# EAGLE board A3660 (EAGLE 8.2.2), part 1 of 3
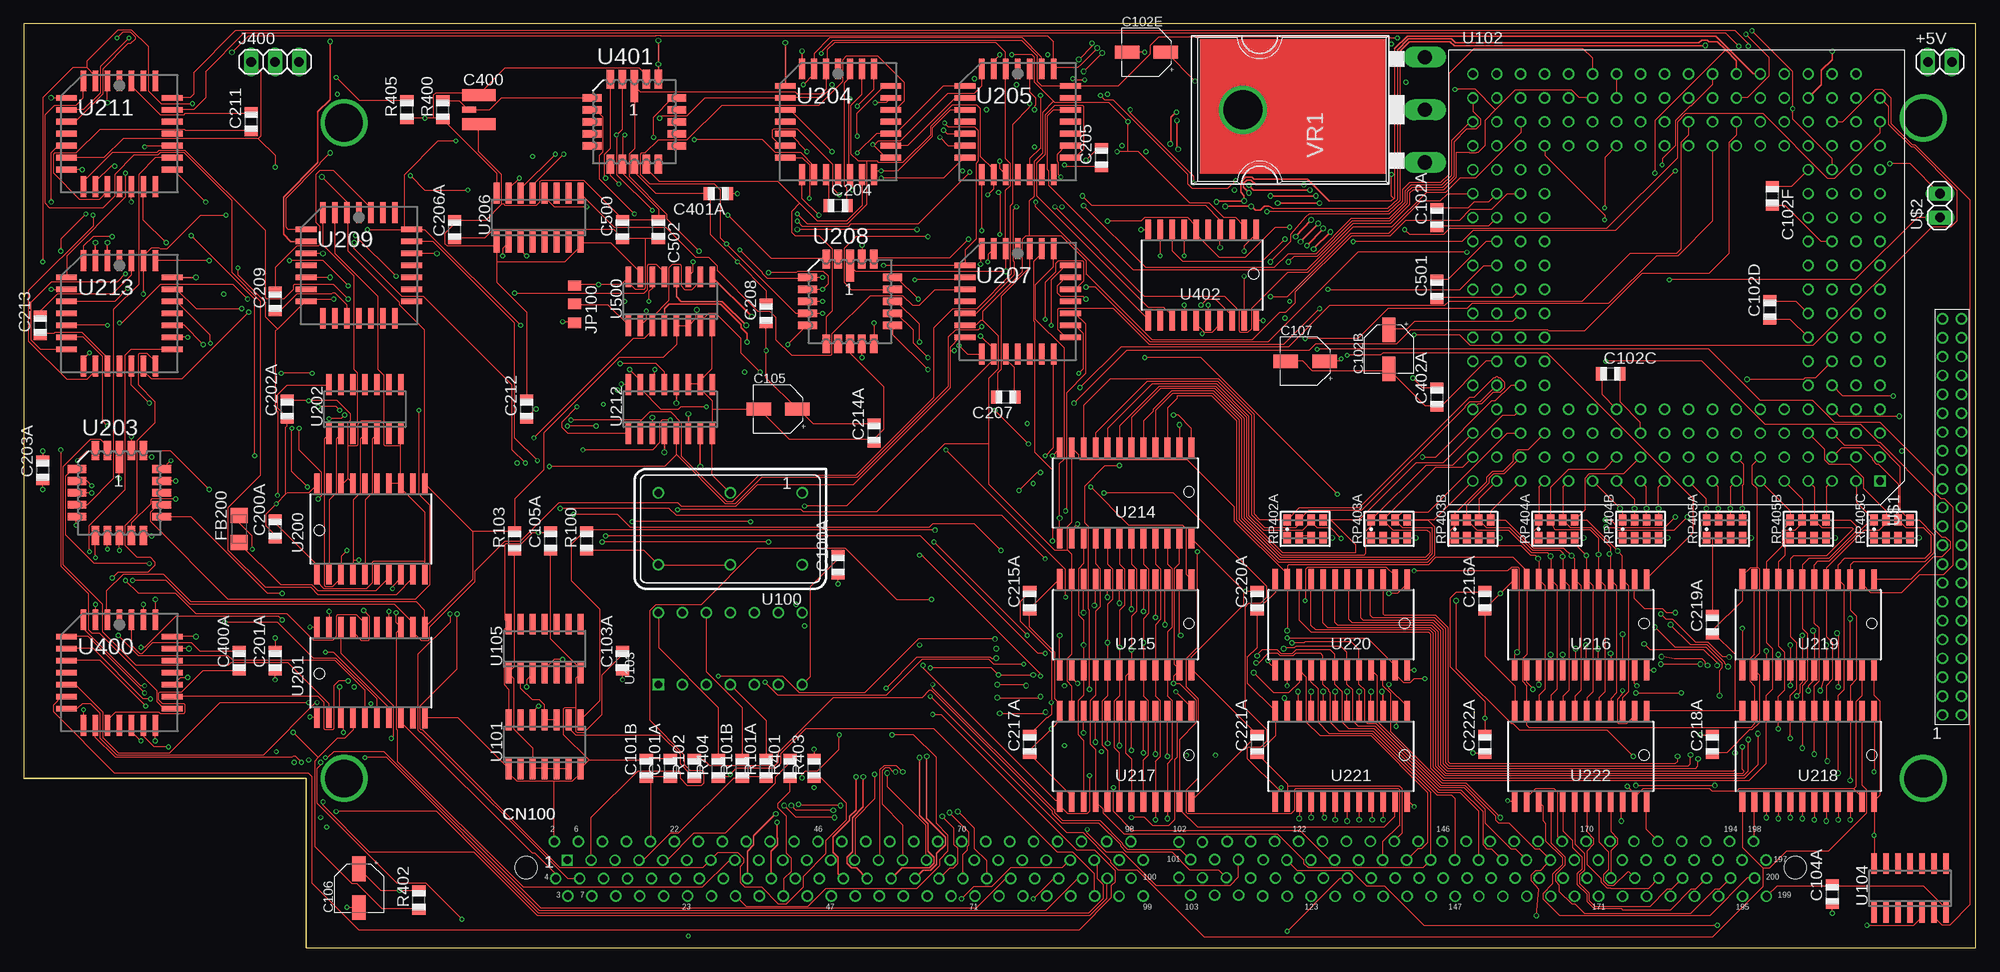
[diagram p11: board, top side]
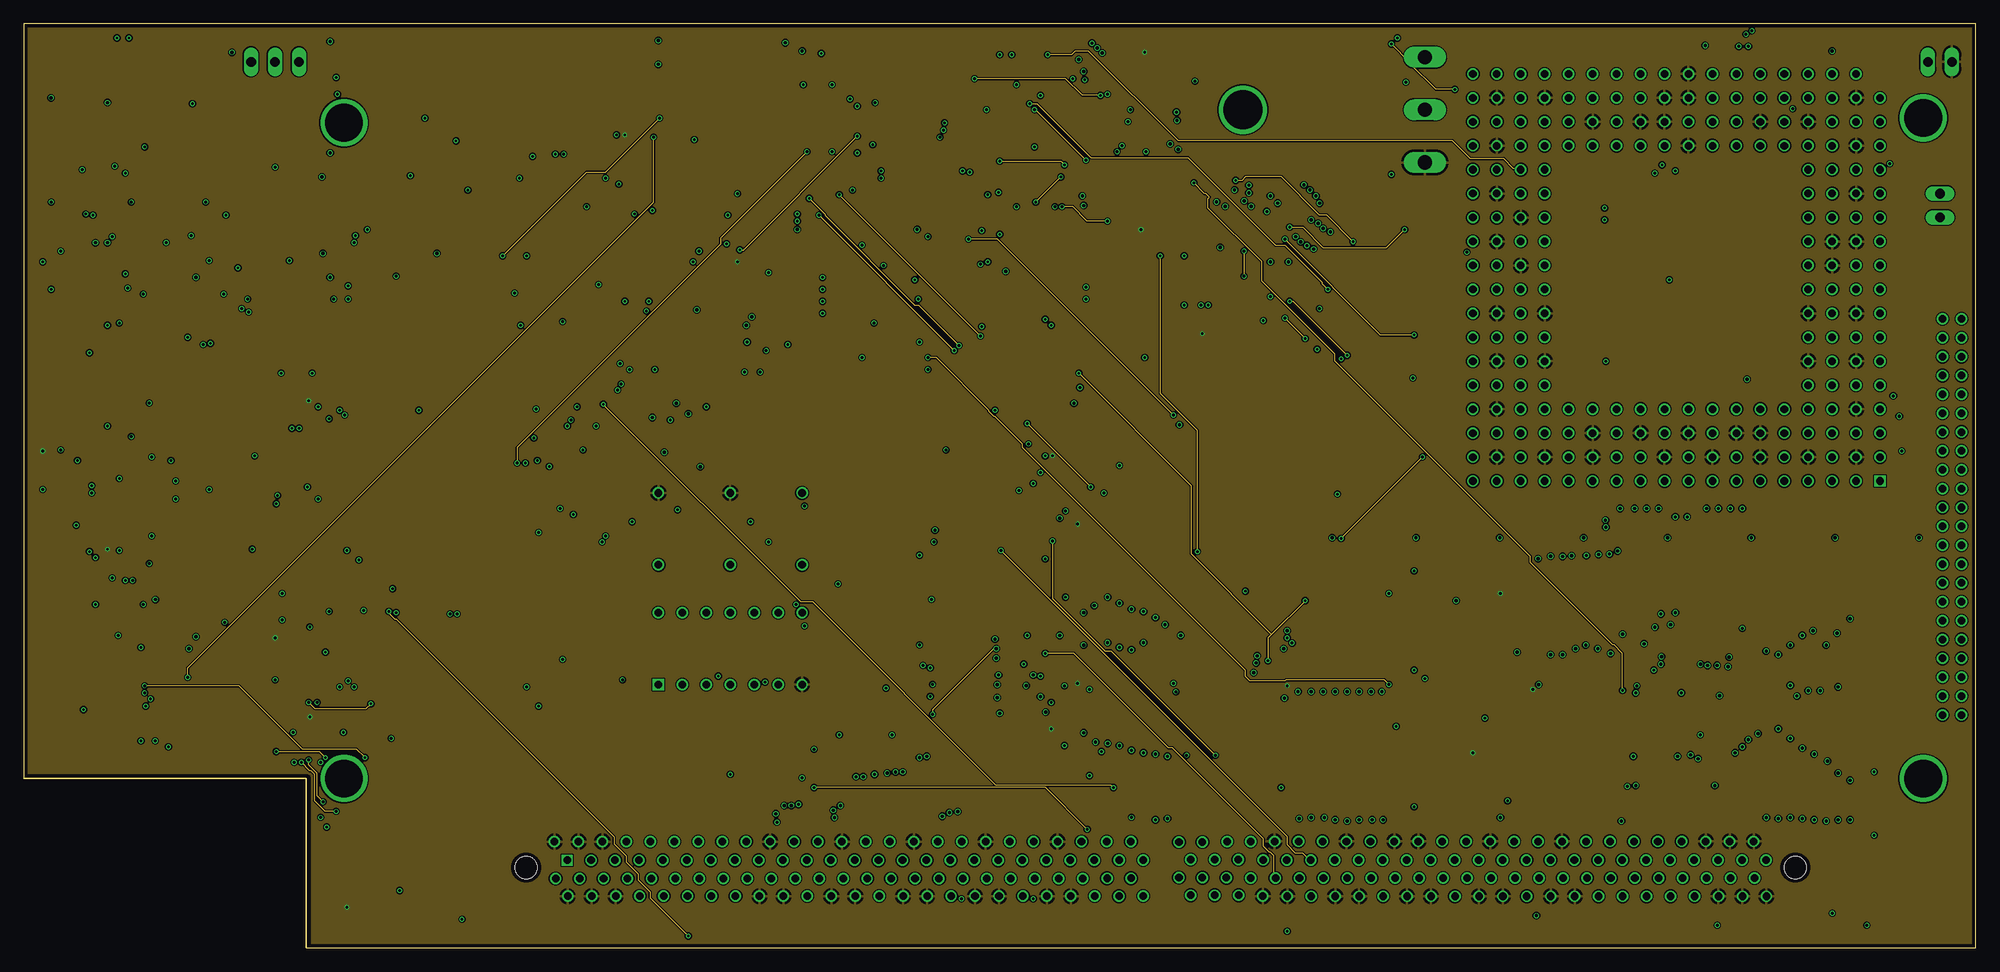
[diagram p12: board, inner layer $GND]
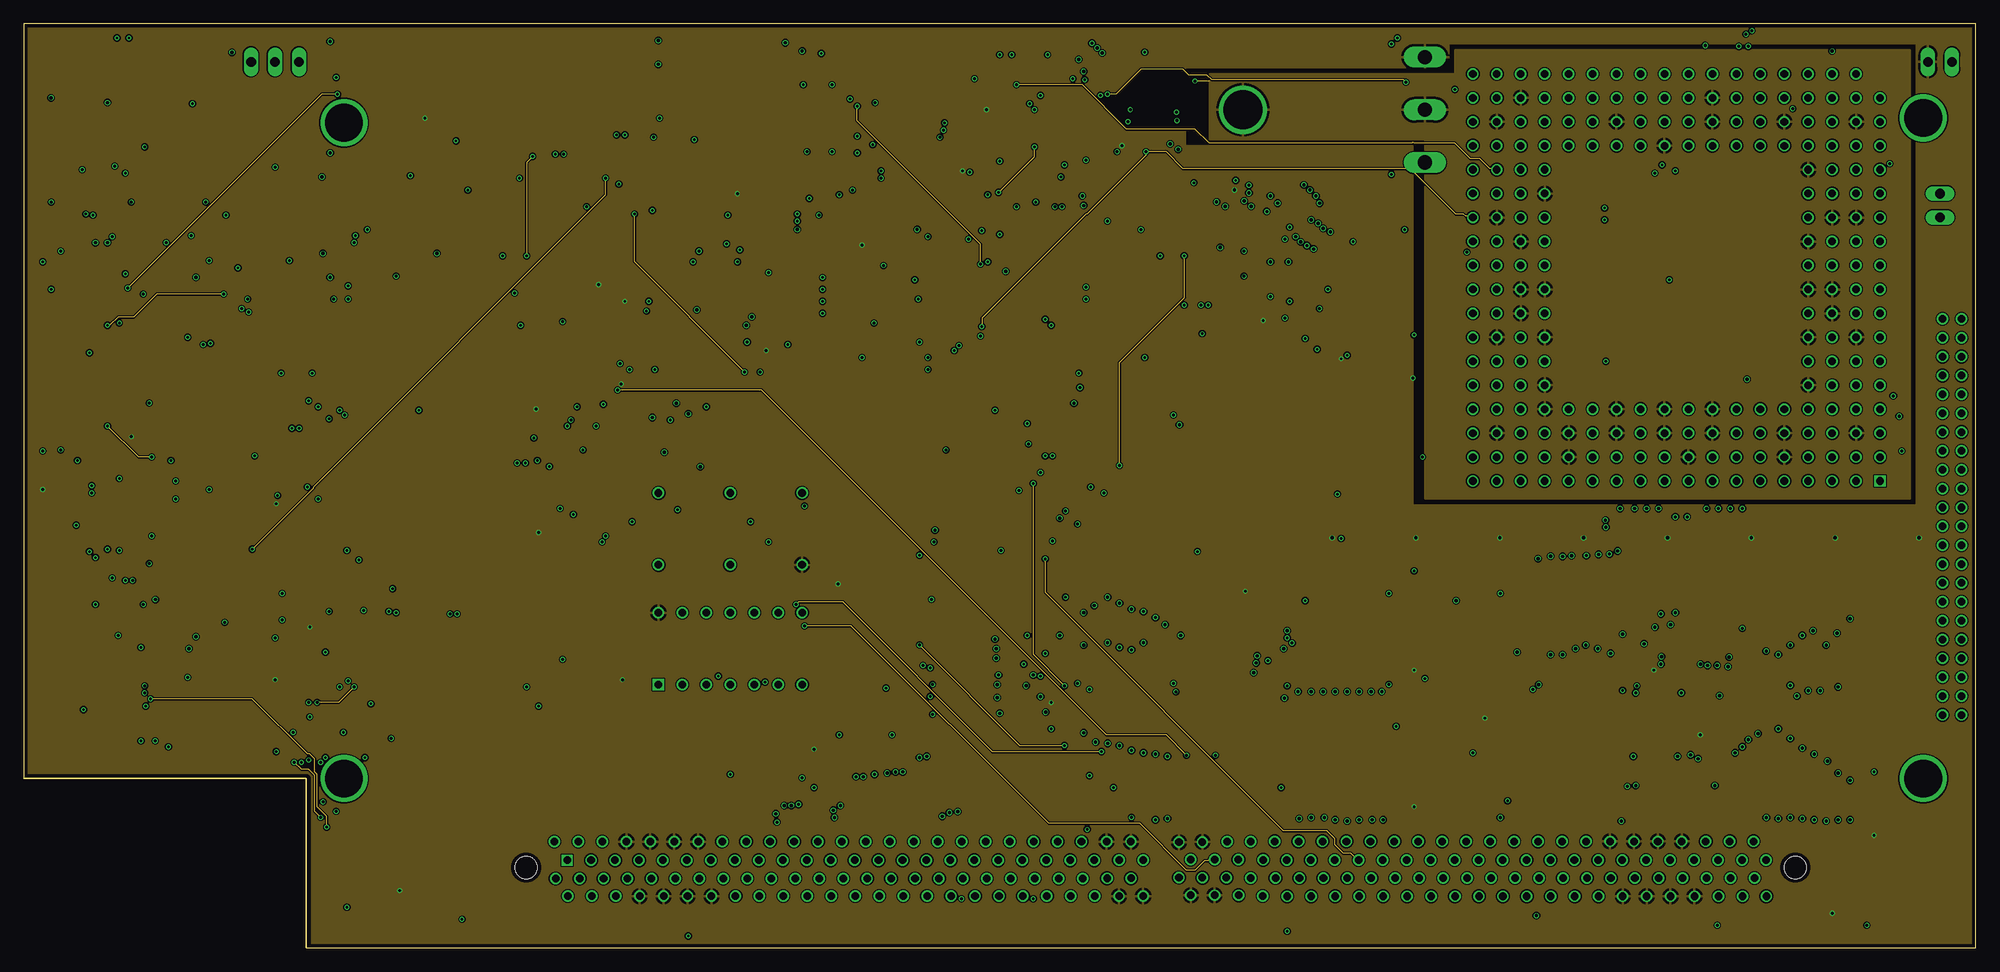
[diagram p13: board, inner layer $VCC]
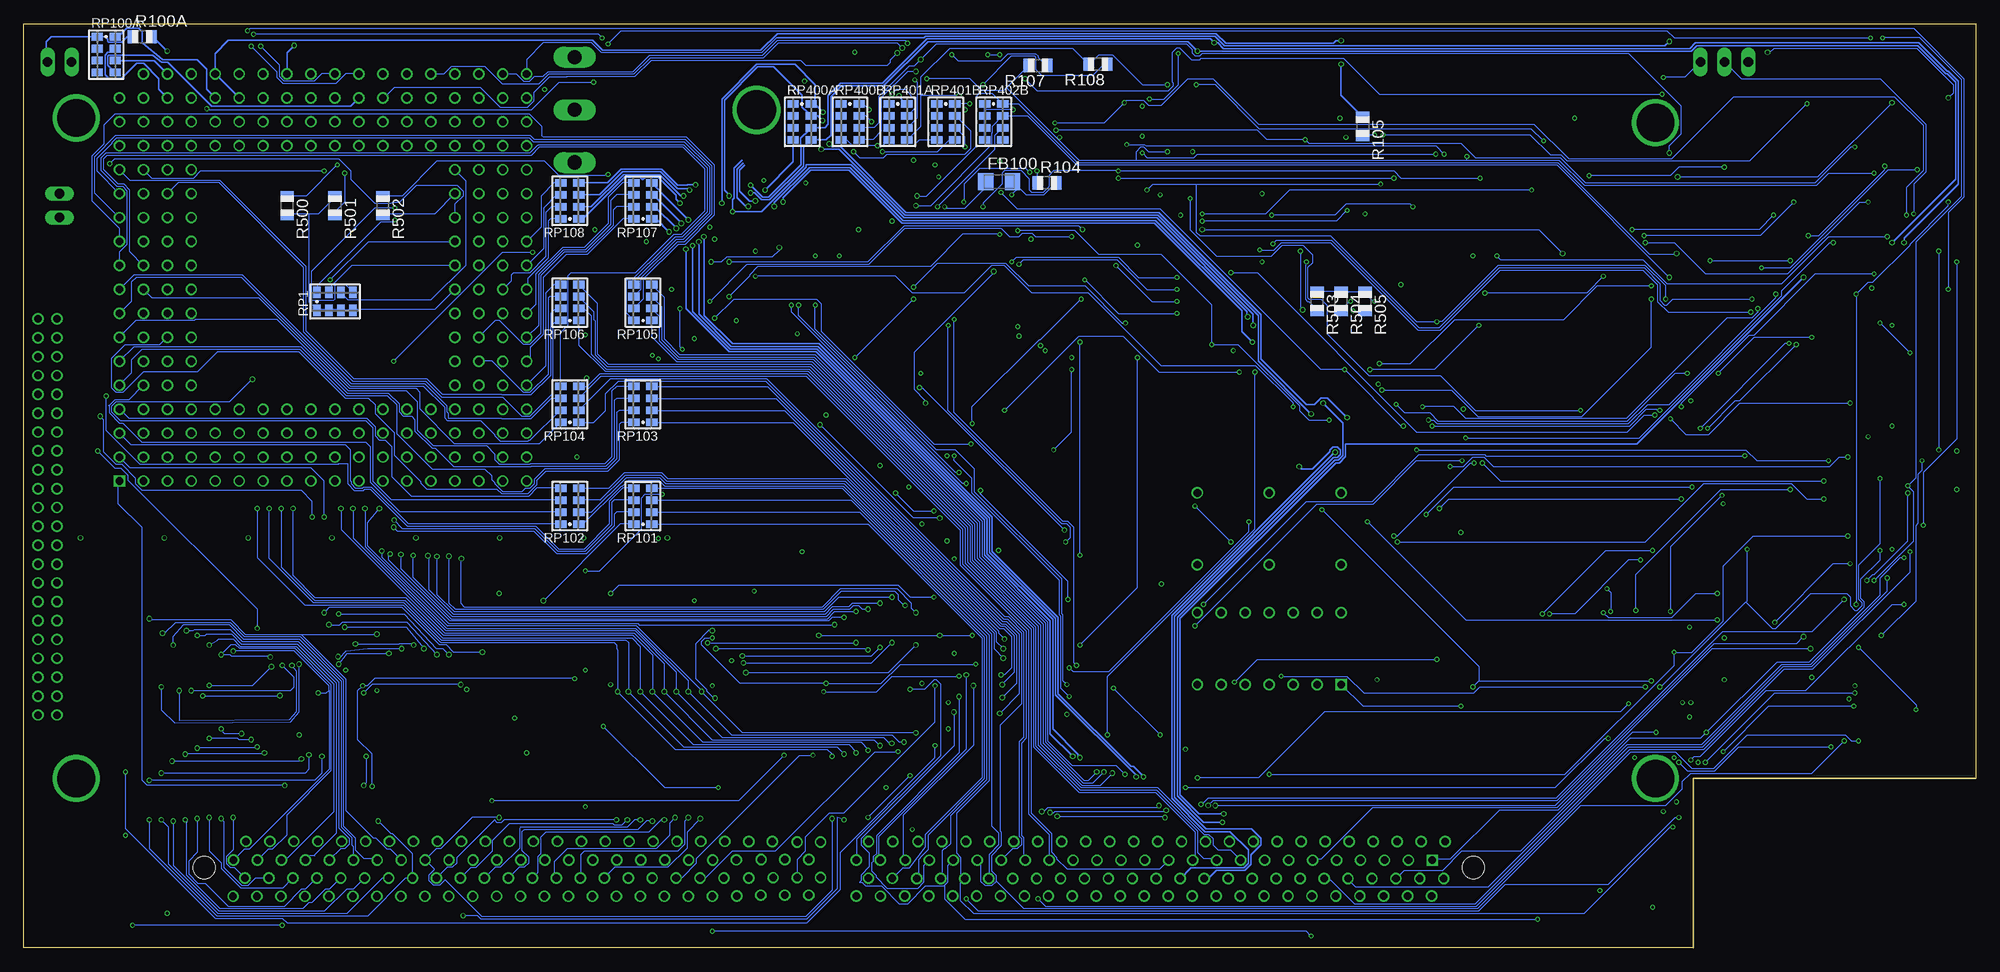
[diagram p14: board, bottom side, seen from below]

Size 207.01 x 98.04 mm. Coordinates in mm from the lower left corner, seen from the top.
Outline: 29.97,0 207.01,0 207.01,98.04 0,98.04 0,17.98 29.97,17.98 29.97,0
Copper layers (1*2*15*16): Top 0.035mm / dielectric 0.2mm / $GND 0.0175mm / dielectric 0.3mm / $VCC 0.0175mm / dielectric 0.2mm / Bottom 0.035mm
Design rules "test": minimum track width 5mil, minimum drill 0.3mm, track to track 5mil, track to pad 5mil, pad to pad 5mil, via to via 8mil, smd to smd 0mil, copper to edge 0.4mm, drill to drill 10mil, minimum pad ring 6mil, minimum via ring 4mil, stop-mask expansion 4mil, vias tented up to drill 100mil, thermal gap 10mil
Net classes: 0 default: width 0.127 mm, clearance 0.127 mm

## Footprints (pad centres in the part's own frame; a part is rotated, then mirrored left to right if it is on the bottom)
1X2PIN = drill 1.016 long: 1 -1.27,0; 2 1.27,0
R0805 = smd 1.1 x 1.4: 1 -1,0; 2 1,0
SMD-ELECTROLYTE = smd 2.6 x 1.4: + 2.05,0; - -2.05,0
RH5VA43A = smd 1.524 x 0.635: 1 -1.016,0 | smd 3.556 x 1.27: 2 0,1.549; 3 0,-1.549
KEL8817-200-170S-F = drill 0.8: 58 -28.112,2.803; 70 -20.492,2.803; 90 -7.792,2.803; 111 8.863,-2.891; 122 15.22,2.828; 123 16.569,-3.001; 146 30.46,2.828; 150 33,2.828; 158 38.08,2.828; 162 40.62,2.828; 170 45.7,2.828; 171 47.049,-3.001; +5V-0 -56.052,2.803; +5V-1 -53.512,2.803; +5V-2 -50.972,2.803; +5V-3 -48.432,2.803; +5V-4 -5.127,2.802; +5V-5 -2.554,2.792; +5V-6 2.545,2.741; +5V-7 5.025,2.763; +5V-8 48.24,2.828; +5V-9 50.78,2.828; +5V-10 53.32,2.828; +5V-11 55.86,2.828; +5V-12 57.209,-3.001; +5V-13 54.669,-3.001; +5V-14 52.129,-3.001; +5V-15 49.589,-3.001; +5V-16 6.318,-2.891; +5V-17 3.795,-2.891; +5V-18 -1.25,-2.975; +5V-19 -3.81,-2.993; +5V-20 -47.02,-2.984; +5V-21 -49.56,-2.984; +5V-22 -52.1,-2.984; +5V-23 -54.64,-2.984; _AS 24.146,0.848; _AVEC -58.463,-1.122; _BERR -44.55,0.824; _BG 6.34,0.907; _BG30 39.429,-3.001; _BGACK -61.003,-1.122; _BOSS -52.17,0.824; _BR -47.09,0.824; _CBACK -48.303,-1.122; _CBR 31.809,-3.001; _CBREQ -45.763,-1.122; _CIIN 20.398,-1.055; _CIOUT 3.795,0.907; _CPURST 8.842,0.907; _DBEN 2.545,-1.013; _DMAEN -21.62,-2.984; _DS -1.235,0.831; _DSACK0 -6.38,-2.984; _EBCLR 11.472,0.864; _ECS -2.537,-1.083; _EMUL -44.48,-2.984; _FPUCS 22.84,2.828; _FPURST 7.655,2.806; _HLT -63.543,-1.122; _INT2 -12.872,2.803; _INT6 -36.86,-2.984; _IPEND 10.135,-1.057; _IPL0 12.778,-1.055; _IPL1 15.318,-1.055; _IPL2 17.858,-1.055; _OCS 22.938,-1.055; _PI2C+ -14,-2.984; _PLSTERM -49.63,0.824; _RAMSLOT -55.923,-1.122; _RESET 13.986,0.848; _RMC 5.025,-1.035; _SBR -57.25,0.824; _SCSI -23.032,2.803; _SENSEZ3P+ 10.145,2.801; _WAIT -29.24,-2.984; A0 -43.223,-1.122; A1 -40.683,-1.122; A2 -38.143,-1.122; A3 -35.603,-1.122; A4 -33.063,-1.122; A5 -30.523,-1.122; A6 -27.983,-1.122; A7 -25.443,-1.122; A8 -42.01,0.824; A9 -39.47,0.824; A10 -36.93,0.824; A11 -34.39,0.824; A12 -31.85,0.824; A13 -29.31,0.824; A14 -26.77,0.824; A15 -24.23,0.824; A16 -21.69,0.824; A17 -19.15,0.824; A18 -16.61,0.824; A19 -14.07,0.824; A20 -11.53,0.824; A21 -8.99,0.824; A22 -6.45,0.824; A23 -3.807,0.837; A24 -22.903,-1.122; A25 -20.363,-1.122; A26 -17.823,-1.122; A27 -15.283,-1.122; A28 -12.743,-1.122; A29 -10.203,-1.122; A30 -7.663,-1.122; A31 -5.08,-1.089; CLK90 17.76,2.828; CPUCLK 24.189,-3.001; D0 45.798,-1.055; D1 48.338,-1.055; D2 50.878,-1.055; D3 53.418,-1.055; D4 55.958,-1.055; D5 58.498,-1.055; D6 61.038,-1.055; D7 63.578,-1.055; D8 43.258,-1.055; D9 40.718,-1.055; D10 38.178,-1.055; D11 35.638,-1.055; D12 33.098,-1.055; D13 30.558,-1.055; D14 28.018,-1.055; D15 25.478,-1.055; D16 47.006,0.848; D17 49.546,0.848; D18 52.086,0.848; D19 54.626,0.848; D20 57.166,0.848; D21 59.706,0.848; D22 62.246,0.848; D23 64.786,0.848; D24 44.466,0.848; D25 41.926,0.848; D26 39.386,0.848; D27 36.846,0.848; D28 34.306,0.848; D29 31.766,0.848; D30 29.226,0.848; D31 26.686,0.848; DIS_CLK30 -15.412,2.803; DIS_CLKS -45.892,2.803; ECLK30 -43.352,2.803; ECLK90 -35.732,2.803; ECLK90A -38.272,2.803; ECPUCLKA -30.652,2.803; EXT90 -54.71,0.824; EXTCPU 7.569,-1.035; FC0 -53.383,-1.122; FC1 -50.843,-1.122; FC2 19.066,0.848; GND0 -63.672,2.803; GND1 -61.132,2.803; GND2 -58.592,2.803; GND3 -40.812,2.803; GND4 -33.192,2.803; GND5 -25.572,2.803; GND6 -17.952,2.803; GND7 -10.332,2.803; GND8 12.68,2.828; GND9 20.3,2.828; GND10 25.38,2.828; GND11 27.92,2.828; GND12 35.54,2.828; GND13 43.16,2.828; GND14 58.4,2.828; GND15 60.94,2.828; GND16 63.48,2.828; GND17 64.829,-3.001; GND18 62.289,-3.001; GND19 59.749,-3.001; GND20 44.509,-3.001; GND21 41.969,-3.001; GND22 36.889,-3.001; GND23 34.349,-3.001; GND24 29.269,-3.001; GND25 26.729,-3.001; GND26 21.649,-3.001; GND27 19.109,-3.001; GND28 14.029,-3.001; GND29 11.429,-2.977; GND30 -8.92,-2.984; GND31 -11.46,-2.984; GND32 -16.54,-2.984; GND33 -19.08,-2.984; GND34 -24.16,-2.984; GND35 -26.7,-2.984; GND36 -31.78,-2.984; GND37 -34.32,-2.984; GND38 -39.4,-2.984; GND39 -41.94,-2.984; GND40 -57.18,-2.984; GND41 -59.72,-2.984; GND42 -62.26,-2.984; R_W -59.79,0.824; SIZ0 16.526,0.848; SIZ1 21.606,0.848 | drill 0.8 square: _DSACK1 -62.33,0.824 | hole 2.362: 67.903,0.042; -66.68,0.042
FERRITE = smd 1.6 x 1.803: 1 -1.422,0; 2 1.422,0
1X3PIN = drill 1.016 long: 1 -2.54,0; 2 0,0; 3 2.54,0
3PAD = smd 1.1 x 1.4: 1 -3.54,0; 2 -1.54,0; 3 0.397,0
RP743-8 = smd 0.8 x 1.2: 1 -1.905,-0.953; 2 -0.635,-0.953; 3 0.635,-0.953; 4 1.905,-0.953; 5 1.905,0.953; 6 0.635,0.953; 7 -0.635,0.953; 8 -1.905,0.953
OSCILLATOR = drill 0.813: 1 -7.62,-3.81; 4 0,-3.81; 7 7.62,-3.81; 8 7.62,3.81; 11 0,3.81; 14 -7.62,3.81
74F1803 = smd 0.6 x 2.2: 1 -3.175,-2.6; 2 -1.905,-2.6; 3 -0.635,-2.6; 4 0.635,-2.6; 5 1.905,-2.6; 6 3.175,-2.6; 7 4.445,-2.6; 8 4.445,2.6; 9 3.175,2.6; 10 1.905,2.6; 11 0.635,2.6; 12 -0.635,2.6; 13 -1.905,2.6; 14 -3.175,2.6
MC68040/68060 = drill 0.8: _AVEC -3.81,21.59; _BB -19.05,21.59; _BG -8.89,21.59; _BGR -3.81,13.97; _BR -21.59,21.59; _BS0 13.97,13.97; _BS1 11.43,13.97; _BS2 8.89,13.97; _BS3 6.35,13.97; _BTT -13.97,13.97; _CDIS 11.43,21.59; _CIOUT 21.59,16.51; _CLA -13.97,1.27; _CLKEN 3.81,13.97; _IPEND 21.59,19.05; _IPL0 3.81,21.59; _IPL1 6.35,21.59; _IPL2 8.89,21.59; _JTAG 13.97,21.59; _LOCK -21.59,19.05; _LOCKE -21.59,16.51; _MDIS 8.89,19.05; _MI -16.51,13.97; _RSTI 6.35,19.05; _RSTO 16.51,16.51; _SAS -11.43,13.97; _SNOOP -13.97,11.43; _TA -11.43,21.59; _TBI -3.81,19.05; _TCI -1.27,21.59; _TEA -8.89,19.05; _TIP -13.97,16.51; _TRA -6.35,13.97; _TRST 16.51,21.59; _TS -16.51,16.51; A0 -21.59,3.81; A1 -21.59,1.27; A2 -19.05,-1.27; A3 -21.59,-1.27; A4 -21.59,-3.81; A5 -21.59,-6.35; A6 -16.51,-6.35; A7 -21.59,-8.89; A8 -21.59,-11.43; A9 -16.51,-8.89; A10 21.59,11.43; A11 16.51,8.89; A12 21.59,8.89; A13 21.59,6.35; A14 21.59,3.81; A15 21.59,1.27; A16 19.05,1.27; A17 21.59,-1.27; A18 21.59,-3.81; A19 19.05,-1.27; A20 21.59,-6.35; A21 21.59,-8.89; A22 21.59,-11.43; A23 16.51,-6.35; A24 21.59,-13.97; A25 16.51,-8.89; A26 19.05,-11.43; A27 21.59,-16.51; A28 16.51,-11.43; A29 21.59,-19.05; A30 16.51,-13.97; BCLK 6.35,16.51; D0 16.51,-16.51; D1 16.51,-19.05; D2 13.97,-16.51; D3 19.05,-21.59; D4 16.51,-21.59; D5 13.97,-21.59; D6 11.43,-21.59; D7 8.89,-21.59; D8 6.35,-19.05; D9 6.35,-21.59; D10 3.81,-21.59; D11 1.27,-21.59; D12 -1.27,-21.59; D13 -3.81,-21.59; D14 -6.35,-21.59; D15 -8.89,-21.59; D16 -3.81,-19.05; D17 -11.43,-21.59; D18 -6.35,-19.05; D19 -13.97,-21.59; D20 -16.51,-21.59; D21 -19.05,-21.59; D22 -16.51,-19.05; D23 -13.97,-16.51; D24 -21.59,-21.59; D25 -16.51,-16.51; D26 -21.59,-19.05; D27 -16.51,-13.97; D28 -21.59,-16.51; D29 -16.51,-11.43; D30 -19.05,-11.43; D31 -21.59,-13.97; DLE 1.27,21.59; GND0 -19.05,8.89; GND1 -19.05,19.05; GND2 -13.97,19.05; GND3 -1.27,19.05; GND4 1.27,19.05; GND5 19.05,19.05; GND6 13.97,16.51; GND7 8.89,16.51; GND8 -1.27,16.51; GND9 -3.81,16.51; GND10 -8.89,16.51; GND11 -19.05,13.97; GND12 1.27,13.97; GND13 19.05,13.97; GND14 19.05,8.89; GND15 19.05,3.81; GND16 16.51,3.81; GND17 16.51,1.27; GND18 13.97,-3.81; GND19 19.05,-3.81; GND20 19.05,-8.89; GND21 13.97,-8.89; GND22 19.05,-13.97; GND23 19.05,-19.05; GND24 13.97,-19.05; GND25 8.89,-19.05; GND26 8.89,-16.51; GND27 6.35,-16.51; GND28 3.81,-19.05; GND29 1.27,-16.51; GND30 -1.27,-19.05; GND31 -3.81,-16.51; GND32 -8.89,-16.51; GND33 -8.89,-19.05; GND34 -13.97,-19.05; GND35 -19.05,-19.05; GND36 -19.05,-13.97; GND37 -19.05,-8.89; GND38 -13.97,-8.89; GND39 -13.97,-3.81; GND40 -19.05,-3.81; GND41 -16.51,1.27; GND42 -19.05,3.81; GND43 -16.51,6.35; N/A 13.97,8.89; N/A1 13.97,6.35; N/A2 13.97,1.27; N/A3 13.97,-13.97; N/A4 11.43,-13.97; N/A5 8.89,-13.97; N/A6 6.35,-13.97; N/A7 1.27,-13.97; N/A8 -3.81,-13.97; N/A9 -8.89,-13.97; N/A10 -11.43,-13.97; PCLK 1.27,16.51; PST0 -13.97,21.59; PST1 -11.43,19.05; PST2 -11.43,16.51; PST3 -16.51,21.59; PST4 -8.89,13.97; R_W -16.51,8.89; SC0 -6.35,21.59; SC1 -6.35,19.05; SIZ0 -19.05,11.43; SIZ1 -16.51,11.43; TCK 13.97,19.05; TDI 16.51,19.05; TDO 19.05,21.59; THERM0 -13.97,3.81; THERM1 -13.97,6.35; TLN0 -21.59,13.97; TLN1 -21.59,11.43; TM0 -21.59,8.89; TM1 -21.59,6.35; TM2 -19.05,1.27; TMS 11.43,19.05; TT0 16.51,11.43; TT1 19.05,11.43; UPA0 16.51,13.97; UPA1 21.59,13.97; VCC0 -13.97,8.89; VCC1 -16.51,19.05; VCC2 3.81,19.05; VCC3 19.05,16.51; VCC4 11.43,16.51; VCC5 3.81,16.51; VCC6 -6.35,16.51; VCC7 -19.05,16.51; VCC8 -1.27,13.97; VCC9 13.97,11.43; VCC10 16.51,6.35; VCC11 19.05,6.35; VCC12 13.97,3.81; VCC13 13.97,-1.27; VCC14 16.51,-1.27; VCC15 16.51,-3.81; VCC16 19.05,-6.35; VCC17 13.97,-6.35; VCC18 13.97,-11.43; VCC19 19.05,-16.51; VCC20 11.43,-16.51; VCC21 11.43,-19.05; VCC22 3.81,-16.51; VCC23 3.81,-13.97; VCC24 1.27,-19.05; VCC25 -1.27,-16.51; VCC26 -1.27,-13.97; VCC27 -6.35,-13.97; VCC28 -6.35,-16.51; VCC29 -11.43,-19.05; VCC30 -11.43,-16.51; VCC31 -19.05,-16.51; VCC32 -13.97,-13.97; VCC33 -13.97,-11.43; VCC34 -13.97,-6.35; VCC35 -19.05,-6.35; VCC36 -16.51,-3.81; VCC37 -16.51,-1.27; VCC38 -13.97,-1.27; VCC39 -16.51,3.81; VCC40 -19.05,6.35 | drill 0.8 square: A31 21.59,-21.59
DELAYLINE = drill 0.8 square: P$1 -3.81,7.62 | drill 0.8: P$2 -3.81,5.08; P$3 -3.81,2.54; P$4 -3.81,0; P$5 -3.81,-2.54; P$6 -3.81,-5.08; P$7 -3.81,-7.62; P$8 3.81,-7.62; P$9 3.81,-5.08; P$10 3.81,-2.54; P$11 3.81,0; P$12 3.81,2.54; P$13 3.81,5.08; P$14 3.81,7.62
7407 = smd 0.6 x 2.2: 1 -3.175,-2.6; 2 -1.905,-2.6; 3 -0.635,-2.6; 4 0.635,-2.6; 5 1.905,-2.6; 6 3.175,-2.6; 8 4.445,2.6; 9 3.175,2.6; 10 1.905,2.6; 11 0.635,2.6; 12 -0.635,2.6; 13 -1.905,2.6; GND 4.445,-2.6; VCC -3.175,2.6
74F04 = smd 0.6 x 2.2: 1 -3.175,-2.6; 2 -1.905,-2.6; 3 -0.635,-2.6; 4 0.635,-2.6; 5 1.905,-2.6; 6 3.175,-2.6; 7 4.445,-2.6; 8 4.445,2.6; 9 3.175,2.6; 10 1.905,2.6; 11 0.635,2.6; 12 -0.635,2.6; 13 -1.905,2.6; 14 -3.175,2.6
74FCT373ASO = smd 0.6 x 2.2: 1 -4.445,-4.775; 2 -3.175,-4.775; 3 -1.905,-4.775; 4 -0.635,-4.775; 5 0.635,-4.775; 6 1.905,-4.775; 7 3.175,-4.775; 8 4.445,-4.775; 9 5.715,-4.8; 10 6.985,-4.8; 11 6.985,4.8; 12 5.715,4.8; 13 4.445,4.8; 14 3.175,4.8; 15 1.905,4.8; 16 0.635,4.8; 17 -0.635,4.8; 18 -1.905,4.8; 19 -3.175,4.8; 20 -4.445,4.8
74FCT374ASO = smd 0.6 x 2.2: 1 -4.445,-4.775; 2 -3.175,-4.775; 3 -1.905,-4.775; 4 -0.635,-4.775; 5 0.635,-4.775; 6 1.905,-4.775; 7 3.175,-4.775; 8 4.445,-4.775; 9 5.715,-4.8; 10 6.985,-4.8; 11 6.985,4.8; 12 5.715,4.8; 13 4.445,4.8; 14 3.175,4.8; 15 1.905,4.8; 16 0.635,4.8; 17 -0.635,4.8; 18 -1.905,4.8; 19 -3.175,4.8; 20 -4.445,4.8
74F32 = smd 0.6 x 2.2: 1 -3.175,-2.6; 2 -1.905,-2.6; 3 -0.635,-2.6; 4 0.635,-2.6; 5 1.905,-2.6; 6 3.175,-2.6; 7 4.445,-2.6; 8 4.445,2.6; 9 3.175,2.6; 10 1.905,2.6; 11 0.635,2.6; 12 -0.635,2.6; 13 -1.905,2.6; 14 -3.175,2.6
GAL16V8 = smd 0.8 x 3.4: 1 0,3.8 | smd 0.8 x 2: 2 -1.27,4.5; 3 -2.54,4.5; 9 -2.54,-4.5; 10 -1.27,-4.5; 11 0,-4.5; 12 1.27,-4.5; 13 2.54,-4.5; 19 2.54,4.5; 20 1.27,4.5 | smd 2 x 0.8: 4 -4.5,2.54; 5 -4.5,1.27; 6 -4.5,0; 7 -4.5,-1.27; 8 -4.5,-2.54; 14 4.5,-2.54; 15 4.5,-1.27; 16 4.5,0; 17 4.5,1.27; 18 4.5,2.54
GAL22V10 = smd 0.6 x 2.2: 1 0,5.6; 2 -1.27,5.6; 3 -2.54,5.6; 4 -3.81,5.6; 12 -3.81,-5.6; 13 -2.54,-5.6; 14 -1.27,-5.6; 15 0,-5.6; 16 1.27,-5.6; 17 2.54,-5.6; 18 3.81,-5.6; 26 3.81,5.6; 27 2.54,5.6; 28 1.27,5.6 | smd 2.2 x 0.6: 5 -5.6,3.81; 6 -5.6,2.54; 7 -5.6,1.27; 8 -5.6,0; 9 -5.6,-1.27; 10 -5.6,-2.54; 11 -5.6,-3.81; 19 5.6,-3.81; 20 5.6,-2.54; 21 5.6,-1.27; 22 5.6,0; 23 5.6,1.27; 24 5.6,2.54; 25 5.6,3.81
74F139 = smd 0.6 x 2.2: 1 -3.175,-2.6; 2 -1.905,-2.6; 3 -0.635,-2.6; 4 0.635,-2.6; 5 1.905,-2.6; 6 3.175,-2.6; 7 4.445,-2.6; 8 5.715,-2.6; 9 5.715,2.6; 10 4.445,2.6; 11 3.175,2.6; 12 1.905,2.6; 13 0.635,2.6; 14 -0.635,2.6; 15 -1.905,2.6; 16 -3.175,2.6
74F257 = smd 0.6 x 2.2: 1 -3.175,-2.6; 2 -1.905,-2.6; 3 -0.635,-2.6; 4 0.635,-2.6; 5 1.905,-2.6; 6 3.175,-2.6; 7 4.445,-2.6; 8 5.715,-2.6; 9 5.715,2.6; 10 4.445,2.6; 11 3.175,2.6; 12 1.905,2.6; 13 0.635,2.6; 14 -0.635,2.6; 15 -1.905,2.6; 16 -3.175,2.6
74FCT543A = smd 0.6 x 2.2: 1 -6.985,-4.775; 2 -5.715,-4.775; 3 -4.445,-4.775; 4 -3.175,-4.775; 5 -1.905,-4.775; 6 -0.635,-4.775; 7 0.635,-4.775; 8 1.905,-4.775; 9 3.175,-4.8; 10 4.445,-4.8; 11 5.715,-4.8; 12 6.985,-4.8; 13 6.985,4.8; 14 5.715,4.8; 15 4.445,4.8; 16 3.175,4.8; 17 1.905,4.8; 18 0.635,4.8; 19 -0.635,4.8; 20 -1.905,4.8; 21 -3.175,4.8; 22 -4.445,4.8; 23 -5.715,4.8; 24 -6.985,4.8
74FCT244A = smd 0.6 x 2.2: 1 -5.715,-4.775; 2 -4.445,-4.775; 3 -3.175,-4.775; 4 -1.905,-4.775; 5 -0.635,-4.775; 6 0.635,-4.775; 7 1.905,-4.775; 8 3.175,-4.775; 9 4.445,-4.8; 10 5.715,-4.8; 11 5.715,4.8; 12 4.445,4.8; 13 3.175,4.8; 14 1.905,4.8; 15 0.635,4.8; 16 -0.635,4.8; 17 -1.905,4.8; 18 -3.175,4.8; 19 -4.445,4.8; 20 -5.715,4.8
2X22 = drill 0.8: 1 -21,1; 2 -21,-1; 3 -19,1; 4 -19,-1; 5 -17,1; 6 -17,-1; 7 -15,1; 8 -15,-1; 9 -13,1; 10 -13,-1; 11 -11,1; 12 -11,-1; 13 -9,1; 14 -9,-1; 15 -7,1; 16 -7,-1; 17 -5,1; 18 -5,-1; 19 -3,1; 20 -3,-1; 21 -1,1; 22 -1,-1; 23 1,1; 24 1,-1; 25 3,1; 26 3,-1; 27 5,1; 28 5,-1; 29 7,1; 30 7,-1; 31 9,1; 32 9,-1; 33 11,1; 34 11,-1; 35 13,1; 36 13,-1; 37 15,1; 38 15,-1; 39 17,1; 40 17,-1; 41 19,1; 42 19,-1; 43 21,1; 44 21,-1
LT1084-3.3 = drill 1.499 long: GND -5.588,-13.97; IN 5.588,-13.97; OUT 0,-13.97 | drill 4.115: OUT2 0,5.334

## Placement (x,y rotation side)
+5V  1X2PIN  [1X2PIN]  203.2,93.98 0 top
C100A  10nF  [R0805]  86.36,40.64 90 top
C101A  100nF  [R0805]  68.58,19.05 90 top
C101B  330nF  [R0805]  66.04,19.05 90 top
C102A  220nF  [R0805]  149.86,77.47 90 top
C102B  22uF  [SMD-ELECTROLYTE]  144.78,63.5 90 top
C102C  220pF  [R0805]  168.28,60.9 0 top
C102D  220nF  [R0805]  185.17,67.69 90 top
C102E  22uF  [SMD-ELECTROLYTE]  119.06,95 0 top
C102F  220pF  [R0805]  185.42,79.76 270 top
C103A  100nF  [R0805]  63.5,30.48 90 top
C104A  100nF  [R0805]  191.77,5.71 90 top
C105  22uF  [SMD-ELECTROLYTE]  80.01,57.15 0 top
C105A  100nF  [R0805]  55.88,43.18 90 top
C106  22uF  [SMD-ELECTROLYTE]  35.56,6.35 90 top
C107  22uF  [SMD-ELECTROLYTE]  135.89,62.23 0 top
C200A  100NF  [R0805]  26.67,44.45 90 top
C201A  100NF  [R0805]  26.67,30.48 90 top
C202A  100nF  [R0805]  27.94,57.15 90 top
C203A  100nF  [R0805]  2.03,50.67 90 top
C204  100nF  [R0805]  86.36,78.74 0 top
C205  100nF  [R0805]  114.3,83.82 90 top
C206A  100nF  [R0805]  45.72,76.2 90 top
C207  100nF  [R0805]  104.14,58.42 180 top
C208  100nF  [R0805]  78.74,67.31 90 top
C209  100nF  [R0805]  26.67,68.58 90 top
C211  100nF  [R0805]  24.13,87.63 90 top
C212  100nF  [R0805]  53.34,57.15 90 top
C213  100nF  [R0805]  1.78,66.04 90 top
C214A  330nF  [R0805]  90.17,54.61 90 top
C215A  330nF  [R0805]  106.68,36.83 90 top
C216A  330nF  [R0805]  154.94,36.83 90 top
C217A  330nF  [R0805]  106.68,21.59 90 top
C218A  330nF  [R0805]  179.07,21.59 90 top
C219A  330nF  [R0805]  179.07,34.29 90 top
C220A  330nF  [R0805]  130.81,36.83 90 top
C221A  330nF  [R0805]  130.81,21.59 90 top
C222A  330nF  [R0805]  154.94,21.59 90 top
C400  RH5VA43A  [RH5VA43A]  48.26,88.9 0 top
C400A  100nF  [R0805]  22.86,30.48 90 top
C401A  100nF  [R0805]  73.66,80.01 180 top
C402A  100nF  [R0805]  149.86,58.42 90 top
C500  10uF  [R0805]  63.5,76.2 90 top
C501  10uF  [R0805]  149.86,69.85 90 top
C502  100nF  [R0805]  67.31,76.2 270 top
CN100  KEL8817-200-170S-F  [KEL8817-200-170S-F]  119.96,8.48 0 top
FB100  80 Ohm / 500mA  [FERRITE]  103.57,81.28 0 bottom
FB200  80 Ohm / 500mA  [FERRITE]  22.86,44.45 90 top
J400  1X3PIN  [1X3PIN]  26.67,93.98 0 top
JP100  3PAD  [3PAD]  58.42,69.85 90 top
R100  1  [R0805]  59.69,43.18 90 top
R100A  1k  [R0805]  194.44,96.65 0 bottom
R101A  22  [R0805]  78.74,19.05 90 top
R101B  22  [R0805]  76.2,19.05 90 top
R102  22  [R0805]  71.12,19.05 90 top
R103  1  [R0805]  52.07,43.18 90 top
R104  4.7K  [R0805]  98.49,81.15 0 bottom
R105  4.7K  [R0805]  65.02,87.12 270 bottom
R107  33  [R0805]  99.44,93.6 180 bottom
R108  33  [R0805]  93.09,93.73 180 bottom
R400  10K  [R0805]  44.45,88.9 90 top
R401  100  [R0805]  81.28,19.05 90 top
R402  470  [R0805]  41.91,5.08 90 top
R403  470  [R0805]  83.82,19.05 90 top
R404  470  [R0805]  73.66,19.05 90 top
R405  4.7K  [R0805]  40.64,88.9 90 top
R500  4.7K  [R0805]  179.07,78.74 270 bottom
R501  4.7K  [R0805]  173.99,78.74 270 bottom
R502  4.7K  [R0805]  168.91,78.74 270 bottom
R503  4.7K  [R0805]  69.85,68.58 270 bottom
R504  4.7K  [R0805]  67.31,68.58 270 bottom
R505  4.7K  [R0805]  64.77,68.58 270 bottom
RP1  4.7K  [RP743-8]  173.99,68.58 0 bottom
RP100A  1K  [RP743-8]  198.25,94.74 270 bottom
RP101  22  [RP743-8]  141.35,46.86 90 bottom
RP102  22  [RP743-8]  149.1,46.86 90 bottom
RP103  22  [RP743-8]  141.35,57.66 90 bottom
RP104  22  [RP743-8]  149.1,57.66 90 bottom
RP105  22  [RP743-8]  141.35,68.45 90 bottom
RP106  22  [RP743-8]  149.1,68.45 90 bottom
RP107  22  [RP743-8]  141.35,79.25 90 bottom
RP108  22  [RP743-8]  149.1,79.25 90 bottom
RP400A  1K  [RP743-8]  124.46,87.63 270 bottom
RP400B  1K  [RP743-8]  119.38,87.63 270 bottom
RP401A  1K  [RP743-8]  114.3,87.63 270 bottom
RP401B  1K  [RP743-8]  109.22,87.63 270 bottom
RP402A  1K  [RP743-8]  135.89,44.45 0 top
RP402B  1K  [RP743-8]  104.14,87.63 270 bottom
RP403A  1K  [RP743-8]  144.78,44.45 0 top
RP403B  1K  [RP743-8]  153.67,44.45 0 top
RP404A  1K  [RP743-8]  162.56,44.45 0 top
RP404B  1K  [RP743-8]  171.45,44.45 0 top
RP405A  1K  [RP743-8]  180.34,44.45 0 top
RP405B  1K  [RP743-8]  189.23,44.45 0 top
RP405C  1K  [RP743-8]  198.12,44.45 0 top
U100  OSCILLATOR  [OSCILLATOR]  74.93,44.45 180 top
U101  74F1803  [74F1803]  54.61,21.59 0 top
U102  MC68040/68060  [MC68040/68060]  175.26,71.12 0 top
U103  DELAYLINE  [DELAYLINE]  74.93,31.75 90 top
U104  7407  [7407]  199.39,6.35 0 top
U105  74F04  [74F04]  54.61,31.75 0 top
U200  74FCT373ASO  [74FCT373ASO]  35.56,44.45 0 top
U201  74FCT374ASO  [74FCT374ASO]  35.56,29.21 0 top
U202  74F32  [74F32]  35.56,57.15 0 top
U203  GAL16V8  [GAL16V8]  10.16,48.26 0 top
U204  GAL22V10  [GAL22V10]  86.36,87.63 0 top
U205  GAL22V10  [GAL22V10]  105.41,87.63 0 top
U206  74F139  [74F139]  53.34,77.47 0 top
U207  GAL22V10  [GAL22V10]  105.41,68.58 0 top
U208  GAL16V8  [GAL16V8]  87.63,68.58 0 top
U209  GAL22V10  [GAL22V10]  35.56,72.39 0 top
U211  GAL22V10  [GAL22V10]  10.16,86.36 0 top
U212  74F257  [74F257]  67.31,57.15 0 top
U213  GAL22V10  [GAL22V10]  10.16,67.31 0 top
U214  74FCT543A  [74FCT543A]  116.84,48.26 180 top
U215  74FCT543A  [74FCT543A]  116.84,34.29 180 top
U216  74FCT543A  [74FCT543A]  165.1,34.29 180 top
U217  74FCT543A  [74FCT543A]  116.84,20.32 180 top
U218  74FCT543A  [74FCT543A]  189.23,20.32 180 top
U219  74FCT543A  [74FCT543A]  189.23,34.29 180 top
U220  74FCT543A  [74FCT543A]  139.7,34.29 180 top
U221  74FCT543A  [74FCT543A]  139.7,20.32 180 top
U222  74FCT543A  [74FCT543A]  165.1,20.32 180 top
U400  GAL22V10  [GAL22V10]  10.16,29.21 0 top
U401  GAL16V8  [GAL16V8]  64.77,87.63 0 top
U402  74FCT244A  [74FCT244A]  124.97,71.37 180 top
U500  74F257  [74F257]  67.31,68.58 0 top
U$1  2X22-2MM  [2X22]  204.47,45.72 90 top
U$2  1X2PIN  [1X2PIN]  203.2,78.74 90 top
VR1  LT1084-3.3  [LT1084-3.3]  134.62,88.9 90 top

## Tracks (layer width: path | path; a pad name or v marks a point on that pad's centre or on a via)
5NS
  Top 0.127: R101B.2 76.2,25.53 72.39,29.34 U103.P$12
10NS
  Top 0.127: R101A.2 78.74,24.13 U103.P$4
030A0  (via drill 0.35)
  Top 0.152: CN100.A0 76.74,10.28 77.42,10.95 77.42,11.88 v79.76,14.22 | v18.29,71.12 U213.25
  Bottom 0.152: v79.76,14.22 82.38,14.22 84.4,16.25 84.4,34.94 67.87,51.46 67.48,51.46 66.83,52.12 66.83,53.47 35.94,53.47 v18.29,71.12
030A1  (via drill 0.35)
  Top 0.152: CN100.A1 79.28,10.28 79.95,10.95 79.95,11.62 79.88,11.69 v79.88,13.34 | v69.22,57.78 U212.12
  Bottom 0.152: v79.88,13.34 81.89,13.34 84.68,16.13 84.68,35.05 67.99,51.74 67.6,51.74 67.11,52.23 67.11,55.68 v69.22,57.78
030A2  (via drill 0.35)
  Top 0.152: v71.75,51.05 U212.7
  Bottom 0.152: CN100.A2 81.41,7.36 80.55,8.22 77.51,8.22 76.87,8.86 76.87,9.89 75.81,10.95 75.81,11.62 76.81,12.62 81.62,12.62 84.96,15.97 84.96,35.17 68.11,52.02 67.72,52.02 67.39,52.35 67.39,52.81 67.72,53.13 68.17,53.13 68.5,52.81 68.5,52.66 70.36,50.8 71.5,50.8 v71.75,51.05
030A3  (via drill 0.35)
  Top 0.152: v67.94,52.58 U212.4
  Bottom 0.152: CN100.A3 83.22,8.5 77.62,8.5 77.15,8.97 77.15,10.42 79.07,12.34 81.73,12.34 85.24,15.85 85.24,35.28 v67.94,52.58
060A0
  Bottom 0.127: RP108.5 150.75,81.15 152.15,79.76 152.15,76.45 U102.A0
060A1
  Bottom 0.127: RP108.6 150.5,79.88 151.89,78.49 151.89,74.17 U102.A1
060A2
  Bottom 0.127: RP108.7 151,78.61 151.64,77.98 151.64,73.3 153.34,71.6 155.09,71.6 155.32,71.37 155.32,70.74 U102.A2
060A3
  Bottom 0.127: RP108.8 151.13,77.34 151.38,77.09 151.38,73.15 153.54,70.99 153.54,69.98 U102.A3
060A4
  Bottom 0.127: RP107.5 143.51,81.15 145.03,79.63 145.03,76.83 147.57,74.3 149.88,74.3 152.73,71.45 152.73,68.25 U102.A4
060A5
  Bottom 0.127: RP107.6 144.15,79.88 144.78,79.25 144.78,76.73 147.47,74.04 149.78,74.04 152.42,71.4 152.42,66.02 U102.A5
060A6
  Bottom 0.127: RP107.7 144.15,78.61 144.53,78.23 144.53,76.62 147.36,73.79 149.67,73.79 152.17,71.29 152.17,65.15 153.34,63.98 154,63.98 156.54,66.52 157,66.52 U102.A6
060A7
  Bottom 0.127: RP107.8 143.45,77.34 147.26,73.53 149.5,73.53 151.91,71.12 151.91,65.05 153.24,63.73 153.29,63.73 153.29,62.61 U102.A7
060A8
  Bottom 0.127: RP106.5 150.75,70.36 151.66,69.45 151.66,61.7 U102.A8
060A9
  Bottom 0.127: RP106.6 151.26,69.09 151.41,68.94 151.41,60.84 153.34,58.9 154,58.9 157.33,62.23 U102.A9
060A10
  Bottom 0.127: RP106.7 150.62,67.82 151.15,67.29 151.15,60.73 153.24,58.65 156.28,58.65 156.31,58.67 162.56,58.67 164.21,60.33 171.96,60.33 177.04,65.41 177.04,72.26 186.18,81.41 195.71,81.41 U102.A10
060A11
  Bottom 0.127: RP106.8 150.5,66.55 150.9,66.14 150.9,58.8 153.34,56.36 154.15,56.36 156.18,58.39 162.64,58.39 164.32,60.07 172.06,60.07 177.29,65.3 177.29,72.16 186.29,81.15 190.63,81.15 U102.A11
060A12
  Bottom 0.127: RP105.5 142.3,70.67 137.79,75.18 137.03,75.18 134.24,77.98 134.24,82.8 136.91,85.47 152.93,85.47 153.34,85.88 197.18,85.88 197.64,85.42 197.64,85.32 199.26,83.69 199.26,82.42 U102.A12
060A13
  Bottom 0.127: RP105.6 141.51,69.88 141.51,71.08 137.67,74.93 136.93,74.93 133.99,77.87 133.99,82.91 136.8,85.72 152.83,85.72 153.24,86.14 197.28,86.14 199.52,83.9 199.52,80.14 U102.A13
060A14
  Bottom 0.127: RP105.7 141.26,68.86 141.26,70.98 137.56,74.68 136.82,74.68 133.73,77.77 133.73,83.01 136.7,85.98 151.89,85.98 152.02,86.11 152.02,87.1 153.34,88.42 197.33,88.42 198.5,87.25 198.5,85.28 199.77,84 199.77,79.27 196.85,76.35 U102.A14
060A15
  Bottom 0.127: RP105.8 143.09,67.34 143.09,70.84 142.98,70.95 142.41,70.95 140.72,72.64 140.69,72.64 137.9,75.44 137.14,75.44 134.49,78.08 134.49,82.7 136.96,85.16 152.45,85.16 152.53,85.09 152.55,85.09 153.34,84.3 198.3,84.3 198.83,83.77 198.83,82.5 197.13,80.8 196.52,80.8 196.06,80.34 196.06,74.6 196.85,73.81 U102.A15
060A16
  Bottom 0.127: RP104.5 150.05,65.28 149.26,66.07 149.26,71.34 148.97,71.63 142.09,71.63 138.03,75.69 137.24,75.69 134.75,78.19 134.75,82.59 137.06,84.91 152.35,84.91 153.21,84.05 198.19,84.05 198.57,83.66 198.57,82.6 197.03,81.06 196.42,81.06 195.81,80.44 195.81,73.89 U102.A16
060A17
  Bottom 0.127: RP104.6 151.05,58.29 153.24,56.1 156.28,56.1 156.31,56.13 161.93,56.13 161.93,56.67 162.08,56.82 162.08,57.48 164.42,59.82 172.21,59.82 183.77,71.37 195.33,71.37 U102.A17
060A18
  Bottom 0.127: RP104.7 150.14,57.02 153.34,53.82 153.44,53.82 153.54,53.72 156.44,53.72 157,54.28 157,54.38 158.5,55.88 162.03,55.88 162.33,56.18 162.33,57.31 164.59,59.56 172.34,59.56 183.9,71.12 195.07,71.12 195.58,70.61 195.58,68.58 U102.A18
060A19
  Bottom 0.127: RP104.8 152.34,53.47 161.29,53.47 164.97,57.15 164.97,58.93 165.35,59.31 172.44,59.31 182.04,68.91 193.37,68.91 U102.A19
060A20
  Bottom 0.127: RP103.5 144.15,59.56 144.65,59.05 144.65,52.07 145.41,51.31 153.31,51.31 153.34,51.28 156.54,51.28 157,51.74 157,52.35 157.86,53.21 163.55,53.21 165.23,54.89 165.23,57.91 166.37,59.05 172.55,59.05 180.13,66.63 188.79,66.63 188.9,66.52 195.1,66.52 U102.A20
060A21
  Bottom 0.127: RP103.6 144.15,58.29 144.4,58.04 144.4,51.97 145.31,51.05 153.21,51.05 153.24,51.03 161.36,51.03 163.3,52.96 163.66,52.96 165.48,54.78 165.48,56.01 165.83,56.36 166.7,56.36 167.16,56.82 167.16,57.69 168.28,58.8 172.66,58.8 177.58,63.72 195.36,63.72 U102.A21
060A22
  Bottom 0.127: RP103.7 143.89,57.02 144.15,56.77 144.15,51.86 145.21,50.8 151.76,50.8 152.88,49.69 152.88,49.2 153.34,48.74 153.83,48.74 154.18,48.39 156.19,48.39 157,49.2 157,49.3 157.35,49.66 157.35,50.04 158.09,50.77 163.65,50.77 167.41,54.54 167.41,57.58 168.38,58.55 172.76,58.55 177.68,63.47 194.47,63.47 195.58,62.36 195.58,60.96 U102.A22
060A23
  Bottom 0.127: RP103.8 143.64,55.75 143.89,55.5 143.89,51.75 145.1,50.55 151.66,50.55 152.62,49.58 152.62,49.1 153.59,48.13 156.29,48.13 156.8,48.64 164.21,48.64 164.85,49.28 164.85,49.43 167.67,52.25 167.67,54.64 169.67,56.64 169.67,56.79 169.7,56.82 169.7,57.56 170.43,58.29 172.87,58.29 177.79,63.22 186.47,63.22 188.59,61.09 194.34,61.09 196.52,58.9 197.18,58.9 197.64,59.36 197.64,62.56 196.22,63.98 192.56,63.98 U102.A23
060A24
  Bottom 0.127: RP102.5 152.6,48.77 153.49,47.88 165.84,47.88 167.92,49.97 167.92,53.11 168.63,53.82 169.24,53.82 169.7,54.28 169.7,55.27 170.56,56.13 195.83,56.13 U102.A24
060A25  (via drill 0.35)
  Top 0.127: v182.75,60.33 188.75,60.33 188.9,60.48 190.02,60.48 U102.A25
  Bottom 0.127: RP102.6 168,47.5 169.95,49.46 169.95,55.15 170.69,55.88 196.7,55.88 197.64,56.82 197.64,57.48 197.18,57.94 185.14,57.94 v182.75,60.33
060A26
  Bottom 0.127: RP102.7 167.09,46.23 170.21,49.35 170.21,53.11 170.69,53.59 194.41,53.59 196.44,55.63 196.8,55.63 197.89,56.72 197.89,57.43 197.99,57.53 197.95,57.53 197.28,58.19 195.81,58.19 U102.A26
060A27
  Bottom 0.127: RP102.8 166.17,44.96 170.08,48.87 171,48.87 171.12,48.74 171.78,48.74 172.24,49.2 172.24,49.43 172.34,49.53 172.34,52.83 172.85,53.34 195.58,53.34 U102.A27
060A28  (via drill 0.35)
  Top 0.127: v198.25,58.55 192.91,58.55 U102.A28
  Bottom 0.127: RP101.5 143.51,48.77 144.91,47.37 144.91,44.96 147.57,42.29 150.24,42.29 152.65,44.7 166.28,44.7 170.19,48.61 170.89,48.61 171.02,48.49 171.88,48.49 172.59,49.2 172.59,51.31 173.63,51.31 173.66,51.28 194.64,51.28 198.25,54.89 v198.25,58.55
060A29  (via drill 0.35)
  Top 0.127: v167.72,45.38 168.3,45.38 169.07,44.61 174.03,44.61 v175.13,45.72
  Bottom 0.127: RP101.6 144.4,47.5 144.65,47.24 144.65,44.85 147.47,42.04 150.35,42.04 152.76,44.45 166.79,44.45 v167.72,45.38 | v175.13,45.72 175.13,49.53 176.53,50.93 195.71,50.93 U102.A29
060A30  (via drill 0.35)
  Top 0.127: v167.77,44.62 168.69,44.62 168.96,44.36 175.04,44.36 v176.4,45.72 | v198.88,56.39 197.21,56.39 197.18,56.36 192.56,56.36 U102.A30
  Bottom 0.127: RP101.7 144.15,46.23 144.4,45.97 144.4,44.75 147.36,41.78 150.45,41.78 152.86,44.2 167.34,44.2 v167.77,44.62 | v176.4,45.72 176.4,47.37 177.55,48.51 194.41,48.51 195.1,49.2 195.1,49.81 196.57,51.28 197.18,51.28 198.5,52.6 198.5,56.01 v198.88,56.39
060A31  (via drill 0.35)
  Top 0.127: v151.89,36.83 151.89,29.67 157.74,23.83 157.91,23.83 158.62,23.11 167.89,23.11 v170.69,20.32 | v170.94,17.24 v179.32,17.24
  Bottom 0.127: RP101.8 143.76,44.96 v151.89,36.83 | v170.69,20.32 170.69,17.49 v170.94,17.24 | v179.32,17.24 193.9,17.24 194.22,17.55 194.22,17.56 194.44,17.78 194.44,44.58 196.98,47.12 196.98,49.4 U102.A31
060D0  (via drill 0.35)
  Top 0.127: U102.D0 193.1,53.28 196.76,53.28 199.01,51.03 199.01,46.42 RP405C.5 200.98,45.4 202.56,43.81 202.56,41.91 201.61,40.96 193.99,40.96 193.68,40.64 U219.3 193.68,35.84 194.32,35.19 194.32,28.46 193.68,27.82 U218.3 v193.68,17.78 | U220.3 144.15,35.43 144.27,35.31 149.71,35.31 151,34.01 151,19.79 151.23,19.56 175.13,19.56 175.39,19.81 v175.39,20.32
  Bottom 0.127: v175.39,20.32 175.39,18.54 176.15,17.78 v193.68,17.78
060D1  (via drill 0.35)
  Top 0.127: U102.D1 192.72,53.02 194.94,53.02 196.06,51.91 196.06,51.74 196.52,51.28 196.69,51.28 198.75,49.21 RP405C.6 199.55,44.61 201.41,44.61 202.23,43.79 202.23,41.93 201.59,41.3 193.06,41.3 192.41,40.64 U219.4 193.03,38.44 193.03,34.66 193.04,34.65 193.04,27.43 192.41,26.8 U218.4 v192.41,18.54 | U220.4 142.75,38.94 142.75,35.31 143,35.05 149.6,35.05 150.75,33.91 150.75,19.68 151.13,19.3 176.53,19.3 176.75,19.52 v176.75,20.48
  Bottom 0.127: v176.75,20.48 176.78,20.45 176.78,18.92 177.16,18.54 v192.41,18.54
060D2  (via drill 0.35)
  Top 0.127: U102.D2 190.98,52.86 190.98,51.74 191.44,51.28 193.68,51.28 195.1,49.86 195.1,48.74 197.49,46.35 RP405C.7 197.49,45.09 196.69,44.29 195.1,44.29 191.13,40.32 U219.5 191.13,33.04 191.78,32.4 191.78,28.46 191.13,27.82 U218.5 191.13,19.94 v191.26,19.81 | U220.5 141.73,38.94 141.73,35.05 141.99,34.8 149.5,34.8 150.5,33.8 150.5,19.58 151.02,19.05 177.29,19.05 177.55,19.3 v177.55,20.07
  Bottom 0.127: v177.55,20.07 177.8,19.81 v191.26,19.81
060D3  (via drill 0.35)
  Top 0.127: U102.D3 194.31,47.31 RP405C.8 195.86,45.4 191.43,40.98 190.2,40.98 189.87,40.64 U219.6 189.87,34.44 190.38,33.92 190.38,28.34 189.87,27.82 U218.6 v189.87,20.57 | U220.6 140.46,38.94 140.46,34.92 140.84,34.54 149.39,34.54 150.24,33.7 150.24,19.47 150.92,18.8 181.36,18.8 181.48,18.92 v181.48,20.7
  Bottom 0.127: v189.87,20.57 188.87,20.57 188.86,20.56 181.62,20.56 v181.48,20.7
060D4  (via drill 0.35)
  Top 0.127: U102.D4 191.13,48.9 RP405B.5 193.68,45.4 194.31,44.77 194.31,44.22 191.41,41.32 189.27,41.32 188.59,40.64 U219.7 188.59,33.91 189.14,33.37 189.14,28.36 188.59,27.82 U218.7 v188.59,21.21 | v182.24,21.34 182.24,18.93 182.46,18.71 182.29,18.54 150.81,18.54 149.99,19.37 149.99,33.59 149.35,34.23 139.38,34.23 139.06,34.54 U220.7
  Bottom 0.127: v182.24,21.34 182.36,21.21 v188.59,21.21
060D5  (via drill 0.35)
  Top 0.127: U102.D5 189.87,48.9 RP405B.6 190.66,44.61 193.83,44.61 193.99,44.45 191.13,41.59 187.64,41.59 187.32,41.27 U219.8 187.32,33.04 187.97,32.4 187.97,27.73 187.96,27.72 187.96,27.43 187.32,26.8 U218.8 v187.32,22.23 | v182.88,22.1 182.88,18.77 182.39,18.29 150.71,18.29 149.73,19.26 149.73,33.47 149.22,33.97 138.3,33.97 137.79,34.48 U220.8
  Bottom 0.127: v187.32,22.23 184.3,22.23 184.16,22.09 183.63,22.09 183.62,22.1 v182.88,22.1
060D6  (via drill 0.35)
  Top 0.127: U102.D6 188.59,47.62 RP405B.7 188.59,45.09 187.8,44.29 186.85,44.29 186.73,44.18 186.73,41.64 186.06,40.96 U219.9 186.06,32.03 186.7,31.38 186.7,27.6 186.69,27.59 186.69,27.3 186.06,26.67 U218.9 v186.06,23.24 | U220.9 136.65,38.96 136.53,38.84 136.53,34.23 137.03,33.72 149.1,33.72 149.48,33.34 149.48,19.16 150.6,18.03 182.5,18.03 183.9,19.43 v183.9,22.73
  Bottom 0.127: v183.9,22.73 185.67,22.73 186.06,23.11 v186.06,23.24
060D7
  Top 0.127: U102.D7 187.32,46.35 RP405B.8 187.32,45.13 186.48,44.28 186.48,42.65 184.78,40.96 U219.10 184.78,32.4 185.42,31.76 185.42,27.43 184.78,26.8 U218.10 184.78,19.56 183.01,17.78 150.5,17.78 149.22,19.05 149.22,33.23 149.01,33.44 136.55,33.44 135.25,34.73 U220.10
060D8  (via drill 0.35)
  Top 0.127: RP405A.5 v182.25,46.61 182.25,49.05 182.4,49.2 182.4,51.28 U102.D8 | v144.02,27.18 144.15,27.05 U221.3 144.15,27.46 | v121.28,20.32 U217.3
  Bottom 0.127: v182.25,46.61 182.25,41.4 177.21,36.37 166.77,36.37 162.79,32.38 144.4,32.38 144.15,32.13 144.15,31.75 144.02,31.62 v144.02,27.18 137.92,21.08 121.79,21.08 121.28,20.57 v121.28,20.32
060D9  (via drill 0.35)
  Top 0.127: RP405A.6 v180.97,46.61 180.97,48.9 U102.D9 | U221.4 v142.88,27.18 | v120.02,20.57 U217.4
  Bottom 0.127: v180.97,46.61 180.97,41.32 176.28,36.62 166.66,36.62 162.68,32.64 143.13,32.64 142.88,32.38 v142.88,27.18 137.03,21.34 120.78,21.34 v120.02,20.57
060D10  (via drill 0.35)
  Top 0.127: RP405A.7 v179.71,46.61 179.71,48.9 U102.D10 | v141.6,27.18 U221.5 | v118.75,20.7 U217.5
  Bottom 0.127: v179.71,46.61 179.71,40.41 176.17,36.87 166.56,36.87 162.58,32.89 142.51,32.89 141.61,32 141.61,27.19 v141.6,27.18 136.02,21.59 119.51,21.59 118.75,20.83 v118.75,20.7
060D11  (via drill 0.35)
  Top 0.127: RP405A.8 v178.44,46.61 178.44,47.62 U102.D11 | U221.6 v140.34,27.18 | v117.47,20.95 U217.6
  Bottom 0.127: v178.44,46.61 178.44,39.5 176.07,37.13 166.45,37.13 162.47,33.15 142.41,33.15 140.34,31.07 v140.34,27.18 135,21.84 118.24,21.84 117.47,21.08 v117.47,20.95
060D12  (via drill 0.35)
  Top 0.127: RP404B.5 v173.35,46.61 173.35,48.9 U102.D12 | v139.06,27.18 U221.7 | v116.2,21.46 U217.7
  Bottom 0.127: v173.35,46.61 173.35,44.39 162.37,33.4 142.3,33.4 139.1,30.2 139.1,27.21 v139.06,27.18 133.99,22.1 116.84,22.1 v116.2,21.46
060D13  (via drill 0.35)
  Top 0.127: RP404B.6 v172.09,46.61 172.09,48.9 U102.D13 | v114.95,21.7 114.94,21.72 U217.8 | v137.79,27.18 U221.8
  Bottom 0.127: v172.09,46.61 172.09,43.48 162.26,33.66 142.2,33.66 137.84,29.3 137.84,27.22 v137.79,27.18 132.97,22.35 115.82,22.35 115.18,21.7 v114.95,21.7
060D14  (via drill 0.35)
  Top 0.127: RP404B.7 v170.81,46.61 170.81,47.62 U102.D14 | U221.9 v136.53,27.18 | v113.67,21.84 U217.9
  Bottom 0.127: v170.81,46.61 170.81,42.57 162.16,33.91 142.09,33.91 136.58,28.39 136.58,27.23 v136.53,27.18 131.95,22.61 114.94,22.61 114.17,21.84 v113.67,21.84
060D15  (via drill 0.35)
  Top 0.127: RP404B.8 169.54,46.35 v169.29,46.61 U102.D15 | v112.39,22.81 U217.10 | v135.13,27.18 135.13,25.25 U221.10
  Bottom 0.127: v169.29,46.61 170.56,45.09 170.56,42.67 162.05,34.16 141.99,34.16 135.13,27.3 v135.13,27.18 130.81,22.86 112.39,22.86 v112.39,22.81
060D16  (via drill 0.35)
  Top 0.127: U102.D16 169.7,50.32 166.04,50.32 165.58,49.86 165.58,46.52 RP404A.5 165.74,45.4 v169.03,42.11 169.54,41.59 U216.3 170.18,38.43 170.18,27.18 169.54,26.54 U222.3 | v121.03,34.29 121.03,38.94 U215.3
  Bottom 0.127: v169.03,42.11 169.03,41.5 161.95,34.42 141.86,34.42 141.73,34.29 v121.03,34.29
060D17  (via drill 0.35)
  Top 0.127: U102.D17 163.19,48.9 RP404A.6 163.99,44.61 166.17,44.61 168.25,42.52 168.25,41.78 | 168.25,41.78 168.25,39.09 U216.4 168.91,38.43 168.91,27.05 168.28,26.42 U222.4 | 168.25,41.78 v168.15,41.78 | 168.28,41.78 168.25,41.78 | U215.4 v120.02,35.05
  Bottom 0.127: v168.15,41.78 168.28,41.78 168.28,41.15 161.8,34.67 121.67,34.67 121.28,35.05 v120.02,35.05
060D18  (via drill 0.35)
  Top 0.127: U102.D18 167.64,50.8 163.83,50.8 161.93,48.9 RP404A.7 162.18,44.7 162.43,44.32 166.11,44.31 167,43.41 v167,41.73 U216.5 167.64,38.43 167.64,27.18 167,26.54 U222.5 | U215.5 v118.75,35.69
  Bottom 0.127: v167,41.73 167,40.24 161.69,34.92 121.77,34.92 121,35.7 119.75,35.7 119.74,35.69 v118.75,35.69
060D19  (via drill 0.35)
  Top 0.127: U102.D19 160.66,48.9 RP404A.8 160.66,44.77 160.06,44.18 160.06,42.82 160.18,42.71 164.62,42.71 v165.7,41.62 165.74,41.59 U216.6 166.37,38.43 166.37,27.18 165.74,26.54 U222.6 | v117.47,35.94 U215.6
  Bottom 0.127: v165.7,41.62 165.74,41.59 165.74,39.33 161.59,35.18 121.88,35.18 121.11,35.95 119.39,35.95 119.01,36.33 118.48,36.33 118.09,35.94 v117.47,35.94
060D20  (via drill 0.35)
  Top 0.127: U102.D20 155.57,46.35 RP403B.5 157.12,45.4 160.07,42.45 163.29,42.45 v164.13,41.61 164.47,41.27 U216.7 165.1,38.43 165.1,27.3 164.47,26.67 U222.7 | v116.2,36.58 U215.7
  Bottom 0.127: v164.13,41.61 164.08,41.56 164.08,38.03 161.48,35.43 121.98,35.43 121.21,36.2 119.5,36.2 119.12,36.59 117.21,36.59 117.2,36.58 v116.2,36.58
060D21  (via drill 0.35)
  Top 0.127: U102.D21 154.31,47.62 RP403B.6 155.1,44.61 157.55,44.61 159.97,42.2 162.91,42.2 163.19,41.91 v163.19,41.52 U216.8 163.83,38.43 163.83,27.3 163.19,26.67 U222.8 | v114.94,37.21 U215.8
  Bottom 0.127: v163.19,41.52 163.19,37.51 161.38,35.69 122.09,35.69 120.55,37.22 115.94,37.22 115.93,37.21 v114.94,37.21
060D22  (via drill 0.35)
  Top 0.127: U102.D22 157,50.32 155.88,50.32 155.42,49.86 155.42,49.37 153.03,46.99 RP403B.7 154.08,44.36 157.45,44.36 159.86,41.95 161.57,41.95 161.93,41.59 v161.93,41.55 U216.9 162.56,38.45 162.56,27.43 161.93,26.8 U222.9 | v113.54,36.32 113.67,36.45 U215.9
  Bottom 0.127: v161.93,41.55 161.93,36.59 161.27,35.94 122.19,35.94 120.28,37.86 114.67,37.86 114.29,37.48 114.29,36.95 113.67,36.32 v113.54,36.32
060D23  (via drill 0.35)
  Top 0.127: U102.D23 159.54,52.86 158.42,52.86 157.96,52.4 157.96,51.64 156.9,50.58 155.78,50.58 155.17,49.96 155.17,49.48 151.76,46.08 RP403B.8 151.76,44.77 151.17,44.18 151.17,42.82 151.29,42.71 158.74,42.71 159.75,41.69 160.24,41.69 160.59,41.34 | 160.59,41.34 160.66,41.27 U216.10 161.29,38.45 161.29,27.43 160.66,26.8 U222.10 | 160.59,41.34 v160.59,41.3 | v112.39,35.56 U215.10
  Bottom 0.127: v160.59,41.3 160.66,41.24 160.66,36.58 160.27,36.2 122.3,36.2 120.38,38.11 114.41,38.11 112.89,36.59 112.89,36.06 v112.39,35.56
060D24
  Top 0.127: U102.D24 149.54,45.4 RP403A.5 148.91,45.4 149.61,44.7 149.61,41.66 148.84,40.89 133.1,40.89 128.65,45.34 128.65,55.88 125.98,58.55 122.3,58.55 122.3,58.29 121.28,57.28 U214.3
060D25
  Top 0.127: U214.4 120.02,57.02 121.79,58.8 126.09,58.8 128.91,55.98 128.91,45.44 133.2,41.15 148.72,41.15 149.35,41.78 149.35,44.58 149.32,44.61 146.21,44.61 RP403A.6 145.41,45.47 146.18,46.23 148.97,46.23 157.35,54.61 U102.D25
060D26
  Top 0.127: U102.D26 152.59,50.99 149.73,50.99 RP403A.7 | RP403A.7 | RP403A.7 145.19,44.36 148.81,44.36 149.1,44.07 149.1,41.89 148.61,41.4 133.31,41.4 129.16,45.55 129.16,56.09 126.19,59.05 121.69,59.05 119.76,57.13 119.76,56.9 118.75,55.88 U214.5
060D27
  Top 0.127: U102.D27 158.12,56.52 156.84,56.52 151.57,51.24 148.72,51.24 RP403A.8 142.88,44.77 142.28,44.18 142.28,41.83 142.11,41.66 133.41,41.66 129.44,45.62 129.44,56.16 126.3,59.31 120.52,59.31 117.47,56.26 U214.6
060D28
  Top 0.127: U102.D28 150.56,51.5 147.7,51.5 141.61,45.4 RP402A.5 138.62,45.4 141.22,42.8 141.22,41.91 133.52,41.91 129.7,45.73 129.7,56.27 126.41,59.56 120.4,59.56 116.2,55.37 U214.7
060D29  (via drill 0.3)
  Top 0.127: 136.53,45.21 135.6,44.29 131.5,44.29 129.95,45.83 129.95,56.38 126.51,59.82 119.63,59.82 114.94,55.12 U214.8 | U102.D29 157.73,59.69 156.08,58.04 155.7,58.04 149.73,52.07 v148.34,52.07 | v139.7,43.43 138.56,44.58 137.16,44.58 136.53,45.21 | 136.53,45.21 RP402A.6
  $GND 0.127: v139.7,43.43 v148.34,52.07
060D30
  Top 0.127: U102.D30 154.46,57.94 153.34,57.94 152.88,57.48 152.88,57.4 141.93,46.45 136.3,46.45 RP402A.7 135.25,44.96 134.84,44.54 131.6,44.54 130.24,45.91 130.24,56.45 126.61,60.07 119.13,60.07 113.67,54.61 U214.9
060D31
  Top 0.127: U102.D31 154.21,57.69 154.57,57.69 155.78,58.9 156.54,58.9 157,59.36 157,60.02 156.54,60.48 156.37,60.48 156.21,60.64 156.05,60.48 155.88,60.48 153.82,58.42 153.35,58.42 141.63,46.7 135.28,46.7 RP402A.8 131.1,45.4 130.49,46.01 130.49,56.55 126.72,60.33 115.19,60.33 112.39,57.53 U214.10
060SIZ0  (via drill 0.3)
  Top 0.127: v85.72,91.57 85.72,91.31 84.58,90.17 U204.6 72.26,90.17 70.36,88.27 67.69,88.27 v67.44,88.01 | U205.16 106.68,83.69 107.82,84.84 v107.82,90.42 | U213.4 6.35,74.42 7.37,75.44 v9.4,75.44 | v50.8,73.41 50.8,74.17 51.44,74.8 U206.2
  $GND 0.127: v67.44,88.01 61.72,82.3 59.69,82.3 v50.8,73.41
  Bottom 0.127: 111.89,90.42 111.89,92.33 108.84,95.38 95.76,95.38 94.11,93.73 R108.2 93.98,93.73 92.96,94.74 91.57,94.74 88.39,91.57 v85.72,91.57 | 111.89,90.42 111.89,87.12 113.28,85.72 RP401A.5 | 111.89,90.42 v107.82,90.42 | v9.4,75.44 15.62,75.44 20.57,70.48 32.77,70.48 35.31,73.03 50.42,73.03 v50.8,73.41
060SIZ1  (via drill 0.3)
  Top 0.127: v112.52,92.08 111.38,92.08 v111.25,92.2 | v10.79,82.17 10.79,79.63 4.57,73.41 4.57,71.12 U213.5 | U206.3 52.7,74.04 v53.34,73.41 | U205.10 98.04,85.09 v97.16,85.98 | U204.7 81.28,88.9 v85.72,84.45
  $VCC 0.127: v53.34,73.41 53.34,83.31 v53.98,83.95
  Bottom 0.127: v112.52,92.08 112.27,91.82 112.27,88.01 113.28,87 RP401A.6 | v111.25,92.2 106.68,92.2 105.41,90.93 103.12,90.93 102.74,91.31 | 102.74,91.31 100.46,93.6 R107.2 | v10.79,82.17 15.62,82.17 16.89,80.9 41.53,80.9 44.2,83.57 53.98,83.57 | 89.03,83.57 95.12,83.57 97.54,85.98 | 89.03,83.57 53.98,83.57 | 97.54,85.98 102.74,91.19 102.74,91.31 | 53.98,83.57 v53.98,83.95 | 97.54,85.98 v97.16,85.98 | v85.72,84.45 87.76,84.45 88.27,84.96 88.52,84.96 89.03,84.45 89.03,83.57
+3V3  (via drill 0.3)
  Top 0.127: U102.VCC37 157.86,68.96 149.86,68.96 C501.1 | U102.VCC40 155.32,76.58 149.86,76.58 C102A.1 | U102.VCC27 167.39,58.67 167.39,60.83 C102C.1 | U102.VCC17 187.32,66.67 185.17,66.67 C102D.1 | U102.VCC9 187.45,80.77 185.42,80.77 C102F.1 | U102.VCC36 157.86,66.42 147.45,66.42 146.69,65.66 144.78,65.66 C102B.+ | v124.21,91.95 121.16,95 C102E.+
  $VCC 0.127: 125.73,91.95 v124.21,91.95
  Bottom 0.127: 173.35,67.69 172.09,67.69 | 173.35,67.69 174.62,67.69 | 173.35,67.69 RP1.3 | 174.62,67.69 175.9,67.69 | 174.62,67.69 RP1.2 | 176.78,77.85 175.77,77.85 173.99,79.63 R501.1 | 176.78,77.85 179.07,77.85 R500.2 | 175.9,67.69 176.78,68.58 176.78,77.85 | 175.9,67.69 RP1.1 | U102.VCC0 163.45,77.85 168.91,77.85 R502.2 | 172.09,67.69 163.45,67.69 U102.VCC38 | 172.09,67.69 RP1.4
  pour $VCC: 146.05,85.72 125.73,85.72 125.73,92.71 151.76,92.71 151.76,95.25 200.03,95.25 200.03,47.62 148.59,47.62 148.59,85.72
+5V  (via drill 0.3, 0.35)
  Top 0.127: 43.43,88.01 44.45,88.01 R400.1 44.45,87.88 50.16,82.17 U206.16 | 43.43,88.01 v42.55,88.01 40.64,88.01 R405.1 | U401.20 66.04,92.58 65.28,93.34 51.05,93.34 48.39,90.68 | 48.39,90.68 48.26,90.55 C400.2 48.39,90.68 | 43.43,88.01 43.43,90.42 43.69,90.68 48.39,90.68 | 129.41,37.85 v129.54,37.85 130.81,37.85 C220A.2 | 129.41,37.85 123.83,43.43 U214.24 | 123.83,29.59 130.81,22.61 | 130.81,22.61 123.83,15.62 U217.24 | 130.81,22.61 C221A.2 | 129.41,37.85 129.41,36.45 123.83,30.86 123.83,29.59 | 123.83,29.59 U215.24 | 63.88,70.87 64.14,71.12 U500.16 63.88,70.87 | 63.88,70.87 63.37,70.36 v60.96,70.36 58.42,70.36 JP100.3 | 63.5,75.31 62.61,76.2 49.78,76.2 48.9,75.31 45.72,75.31 C206A.1 | 63.5,75.31 65.91,75.31 | 65.91,75.31 67.31,75.31 C502.2 | 63.5,75.31 C500.1 | 63.88,70.87 64.9,69.85 65.79,69.85 65.91,69.98 65.91,75.31 | C105A.2 55.88,44.07 v54.61,44.07 53.98,44.07 52.83,42.93 51.18,42.93 51.05,42.8 51.05,34.8 51.44,34.42 U105.14 51.44,34.29 50.93,33.78 50.93,27.94 51.44,27.43 U101.14 | C200A.1 26.67,43.81 25.65,44.83 25.65,45.97 v26.8,47.12 27.81,48.13 | 27.81,48.13 27.94,48.26 30.23,48.26 31.11,49.15 U200.20 | 27.81,48.13 27.81,55.24 27.94,55.37 C202A.1 27.94,56.26 26.92,57.28 26.92,58.67 27.94,59.69 32.38,59.69 U202.14 | U104.VCC v196.22,11.94 U218.24 196.22,15.62 196.85,16.26 196.85,26.16 196.22,26.8 U219.24 | C208.1 v78.74,63.37 78.74,60.45 82.04,57.15 C105.+ 82.17,57.15 83.69,55.63 90.17,55.63 C214A.2 | C222A.2 v154.94,24.38 154.94,26.16 151.26,29.84 151.26,37.08 151.89,37.72 154.94,37.72 C216A.2 | C217A.2 106.68,22.61 108.46,24.38 108.58,24.38 108.97,24.77 v108.97,26.04 108.97,31.37 105.66,34.67 105.66,36.7 106.68,37.72 C215A.2
  Top 0.127: R402.2 41.91,6.1 v39.88,6.1 37.85,6.1 35.56,8.38 C106.+ | 66.55,18.16 68.58,18.16 C101A.1 | 66.55,18.16 66.04,18.16 C101B.1 66.55,18.16 | RP402A.2 135.25,43.56 135.38,43.69 136.4,43.69 136.53,43.56 RP402A.3 | 137.79,43.56 RP402A.4 | 144.15,43.56 RP403A.2 | 145.41,43.56 RP403A.3 | 146.69,43.56 RP403A.4 | 153.03,43.56 RP403B.2 | 154.31,43.56 RP403B.3 | 155.57,43.56 RP403B.4 | 161.93,43.56 RP404A.2 | 163.19,43.56 RP404A.3 | 164.47,43.56 RP404A.4 | 170.81,43.56 RP404B.2 | 172.09,43.56 RP404B.3 | 173.35,43.56 RP404B.4 | 179.71,43.56 RP405A.2 | 180.97,43.56 RP405A.3 | 182.25,43.56 RP405A.4 | 188.59,43.56 RP405B.2 | 189.87,43.56 RP405B.3 | 191.13,43.56 RP405B.4 | 197.49,43.56 RP405C.2 | 198.75,43.56 RP405C.3 | 200.03,43.56 RP405C.4 | v2.03,48.64 C203A.1 | v26.67,28.45 C201A.1 | R404.2 73.66,25.53 67.31,31.88 U103.P$14 | v63.5,28.45 C103A.1 | v83.82,21.08 R403.2 | v54.36,57.15 54.23,57.15 53.34,56.26 C212.1 | v75.69,80.01 C401A.1 | v86.36,38.61 C100A.1 | v191.77,3.68 C104A.1 | v177.8,22.61 179.07,22.61 C218A.2 | v147.32,60.45 148.34,59.44 149.86,59.44 C402A.2 | 179.07,43.5 C219A.2 | v11.43,54.23 U203.20 | v88.9,74.55 U208.20 | v30.35,34.04 31.11,34.04 U201.20 | v63.37,59.82 64.14,59.82 U212.16 | v147.45,14.99 146.94,15.49 146.69,15.49 U221.24 | v147.45,29.46 146.69,29.46 U220.24 | U222.24 172.09,12.57 173.23,11.43 CN100.+5V-10 | v131.44,66.55 130.68,66.55 U402.20 | v172.85,29.46 172.09,29.46 U216.24 | 66.55,18.16 66.55,11.3 CN100.+5V-1 | C107.+ 139.45,62.23 v139.7,62.48
  Top 0.152: RP405C.1 RP405C.2 RP405C.3 RP405C.4 v200.98,43.5 | RP405B.1 RP405B.2 RP405B.3 RP405B.4 v192.09,43.5 | RP405A.1 179.07,43.5 RP405A.2 RP405A.3 RP405A.4 v183.2,43.5 | RP404B.1 RP404B.2 RP404B.3 RP404B.4 v174.31,43.5 | RP404A.1 RP404A.2 RP404A.3 RP404A.4 v165.42,43.5 | RP403B.1 RP403B.2 RP403B.3 RP403B.4 v156.53,43.5 | RP403A.1 RP403A.2 RP403A.3 RP403A.4 v147.64,43.5 | RP402A.1 RP402A.2 RP402A.3 RP402A.4 v138.75,43.5
  Bottom 0.127: 120.4,87 120.4,85.72 RP400B.4 119.76,85.72 119.13,85.09 v116.46,85.09 115.95,85.09 115.32,85.72 | 120.4,88.27 120.4,89.53 RP400B.1 | 120.4,88.27 120.4,87 | 120.4,87 RP400B.3 | 120.4,88.27 RP400B.2 | 110.24,87 110.24,85.72 | 110.24,88.27 110.24,89.53 RP401B.1 | 110.24,88.27 110.24,87 | 110.24,87 RP401B.3 | 110.24,88.27 RP401B.2 | 115.32,87 115.32,85.72 | 115.32,88.27 115.32,89.53 RP401A.1 | 115.32,88.27 115.32,87 | 115.32,87 RP401A.3 | 115.32,88.27 RP401A.2 | 110.24,85.72 112.01,85.72 112.65,85.09 114.55,85.09 115.19,85.72 RP401A.4 115.32,85.72 | 110.24,85.72 RP401B.4 | 67.31,69.6 64.77,69.6 R505.1 64.77,69.47 63.88,68.58 v63.75,68.58 | 67.31,69.6 69.85,69.6 R503.1 | 67.31,69.6 R504.1 | 105.16,87 105.16,85.72 RP402B.4 | 105.16,88.9 105.16,89.53 RP402B.1 | 105.16,88.9 105.16,88.27 | 105.16,88.27 105.16,87 | 105.16,87 RP402B.3 | 105.16,88.27 RP402B.2 | 125.48,85.72 RP400A.4 | 125.48,87 RP400A.3 | 125.48,88.27 RP400A.2 | v99.57,82.42 99.57,81.15 R104.1 | v102.11,88.9 105.16,88.9
  Bottom 0.152: RP400A.1 RP400A.2 RP400A.3 RP400A.4 125.41,83.38 v128.4,80.39
  pour $VCC: 207.01,97.79 207.01,0 29.84,0 29.84,17.78 0,17.78 0,97.79 123.19,97.79 123.19,85.09 147.32,85.09 147.32,46.99 147.96,46.99 200.66,46.99 200.66,97.79
  pour $VCC: 200.66,97.79 200.66,95.89 151.13,95.89 151.13,93.34 123.19,93.34 123.19,97.79
_060CIOUT  (via drill 0.3)
  Top 0.127: v114.94,77.09 118.49,77.09 118.87,77.47 123.44,77.47 124.33,76.58 U402.6 124.33,75.69 126.75,73.28 129.54,73.28 132.72,76.45 v134.24,76.45 | U102._CIOUT 196.85,86.49 192.02,81.66 191.26,81.66 184.4,88.52 176.28,88.52 175.39,87.63 175.39,83.82 167.89,76.33 151.26,76.33 150.62,75.69 146.94,75.69 v146.43,76.2
  $GND 0.127: v110.11,78.61 111.25,78.61 112.78,77.09 v114.94,77.09 | v146.43,76.2 144.53,74.3 137.79,74.3 135.64,76.45 v134.24,76.45
  Bottom 0.127: v110.11,78.61 104.01,84.71 104.01,86.23 103.25,87 RP402B.6
_060EMUL  (via drill 0.35)
  Top 0.152: U401.19 v67.31,93.73 v67.31,96.24
  Bottom 0.152: U102._MDIS U102._CDIS 186.69,94.87 185.29,96.27 146.69,96.27 145.61,95.19 128.85,95.19 127.06,96.98 80.56,96.98 79.54,95.96 68.12,95.96 67.85,96.24 v67.31,96.24 | R105.1 65.02,88.14 67.31,90.42 v67.31,93.73
_060IPEND  (via drill 0.3)
  Top 0.127: U402.8 121.79,73.91 122.94,72.77 131.32,72.77 v133.73,75.18 | v147.45,65.02 152.27,65.02 153.42,63.88 189.74,63.88 202.31,76.45 204.34,76.45 204.98,77.09 204.98,80.39 200.41,84.96 200.15,84.96 197.74,87.38 197.74,89.28 U102._IPEND
  $GND 0.127: v133.73,75.18 143.89,65.02 v147.45,65.02
_060IPL0  (via drill 0.3, 0.35)
  Top 0.127: 145.92,95.12 145.92,79.25 144.65,78.11 v131.83,78.11 | v173.74,83.06 173.74,83.69 175.13,85.09 175.13,87.76 176.66,89.28 176.78,89.28 179.07,91.57 U102._IPL0
  Top 0.152: v178.31,95.71 151.69,95.71 151.26,96.14 146.94,96.14 145.92,95.12 | v76.63,66.04 76.58,66.04 74.04,68.58 69.72,68.58 69.22,69.09 U500.12
  Bottom 0.127: v173.74,83.06 177.04,79.76 179.07,79.76 R500.1
  Bottom 0.152: U102._IPL0 179.07,94.95 v178.31,95.71 | 130.81,83.57 131.65,82.72 131.65,79.53 131.83,79.35 v131.83,78.11 128.75,78.11 124.03,82.83 124.03,83.06 119.27,83.06 113.65,77.44 86.86,77.44 76.65,67.24 76.65,66.06 v76.63,66.04
_060IPL1  (via drill 0.3, 0.35)
  Top 0.127: 145.64,95.24 145.64,79.36 144.58,78.43 132.54,78.43 | v172.97,82.17 172.97,87.76 180.47,95.25
  Top 0.152: U102._IPL1 181.61,94.11 180.47,95.25 179.58,96.14 178.66,96.14 178.54,96.27 177.93,96.27 177.65,95.99 151.8,95.99 151.37,96.42 146.82,96.42 145.64,95.24 | v127.42,78.65 127.43,78.66 v130.18,78.66 130.6,78.23 131.17,78.23 131.6,78.66 132.06,78.66 132.54,78.43 | v77.21,66.93 77.21,67 U500.9
  Bottom 0.127: R501.2 173.99,78.11 172.97,79.12 v172.97,82.17
  Bottom 0.152: v130.18,78.66 130.48,78.66 131.37,79.56 131.37,82.61 130.74,83.24 | v127.42,78.65 127.42,79.04 123.68,82.78 119.38,82.78 113.77,77.17 86.97,77.17 77.29,67.49 77.29,67.02 v77.21,66.93
_060IPL2  (via drill 0.3, 0.35)
  Top 0.127: 145.32,79.45 145.36,79.48 145.36,95.35 | 145.32,79.45 144.96,79.2 138.48,79.2 | v145.03,82.04 145.03,79.76 145.29,79.5 145.32,79.45
  Top 0.152: U102._IPL2 183.4,92.71 179.41,96.7 146.71,96.7 145.36,95.35 | 138.48,79.2 136.14,81.53 130.47,81.53 130.27,81.73 129.57,81.73 129.09,81.25 129.09,80.14 129.41,79.81 129.41,79.25 v129.43,79.23 126.6,79.23 v126.49,79.12 | v76.71,64.26 76.71,65.17 76.07,65.81 76.07,66.14 73.91,68.3 68.43,68.3 67.94,67.82 U500.4
  Bottom 0.127: v145.03,82.04 145.16,81.92 150.24,81.92 151.76,83.44 163.19,83.44 166.88,79.76 168.91,79.76 R502.1